# Altium schematic sheet Peripherals.SchDoc
size A4
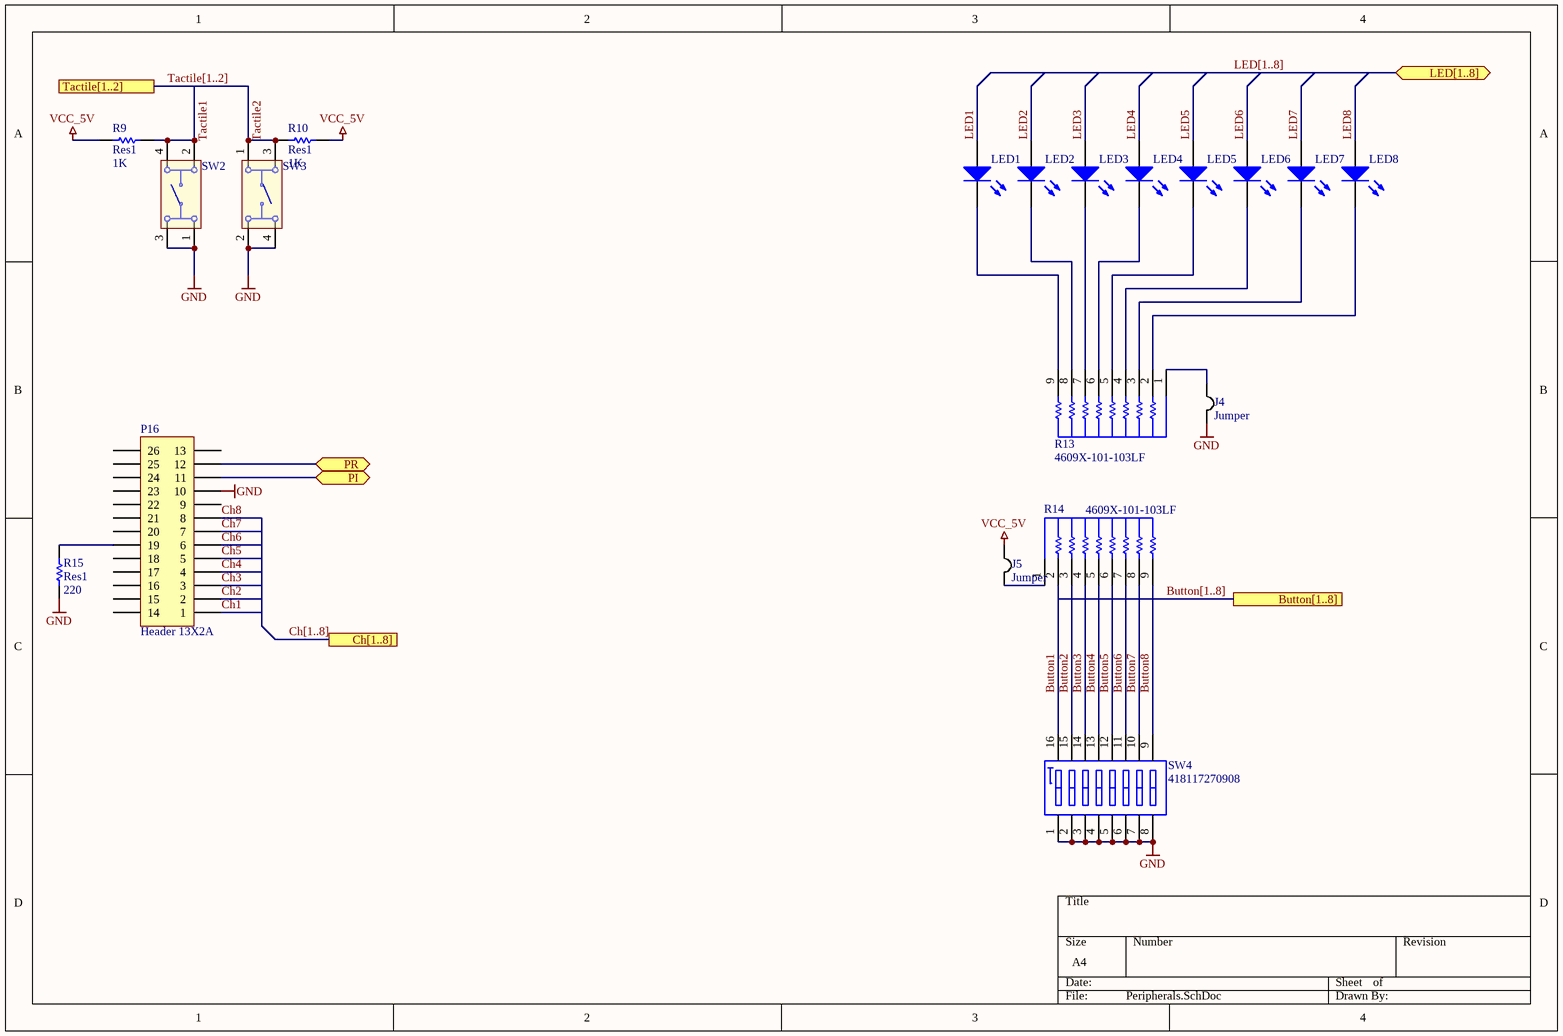
[diagram p0: Peripherals.SchDoc]

## Parts
J4  Jumper  [SMDJumper]
J5  Jumper  [SMDJumper]
LED1  TX1  [Type 3mm]  (value not drawn)
LED2  TX1  [Type 3mm]  (value not drawn)
LED3  TX1  [Type 3mm]  (value not drawn)
LED4  TX1  [Type 3mm]  (value not drawn)
LED5  TX1  [Type 3mm]  (value not drawn)
LED6  TX1  [Type 3mm]  (value not drawn)
LED7  TX1  [Type 3mm]  (value not drawn)
LED8  TX1  [Type 3mm]  (value not drawn)
P16  Header 13X2A  [HDR2X13_CEN]
R9  Res1  value 1K  [AXIAL-0.3]
R10  Res1  value 1K  [AXIAL-0.3]
R13  4609X-101-103LF  [BOUR-4609X]
R14  4609X-101-103LF  [BOUR-4609X]
R15  Res1  value 220  [AXIAL-0.3]
SW2  430156130726  [430156130726]  (value not drawn)
SW3  430156130726  [430156130726]  (value not drawn)
SW4  418117270908  [418117270908]

## Ports
Button[1..8], Ch[1..8], LED[1..8] (bidir), PI (bidir), PR (bidir), Tactile[1..2]

## Nets
GND: J4.2 P16.10 R15.1 SW2.1 SW2.3 SW3.2 SW3.4 SW4.1 SW4.2 SW4.3 SW4.4 SW4.5 SW4.6 SW4.7 SW4.8
VCC_5V: J5.1 R9.1 R10.2
Button1: R14.2 SW4.16
Button2: R14.3 SW4.15
Button3: R14.4 SW4.14
Button4: R14.5 SW4.13
Button5: R14.6 SW4.12
Button6: R14.7 SW4.11
Button7: R14.8 SW4.10
Button8: R14.9 SW4.9
Ch1: P16.1
Ch2: P16.2
Ch3: P16.3
Ch4: P16.4
Ch5: P16.5
Ch6: P16.6
Ch7: P16.7
Ch8: P16.8
LED1: LED1.2(A)
LED2: LED2.2(A)
LED3: LED3.2(A)
LED4: LED4.2(A)
LED5: LED5.2(A)
LED6: LED6.2(A)
LED7: LED7.2(A)
LED8: LED8.2(A)
PI: P16.11 ; port PI
PR: P16.12 ; port PR
Tactile1: R9.2 SW2.2 SW2.4
Tactile2: R10.1 SW3.1 SW3.3
NetJ4_1: J4.1 R13.1
NetJ5_2: J5.2 R14.1
NetLED1_1: LED1.1(K) R13.9
NetLED2_1: LED2.1(K) R13.8
NetLED3_1: LED3.1(K) R13.7
NetLED4_1: LED4.1(K) R13.6
NetLED5_1: LED5.1(K) R13.5
NetLED6_1: LED6.1(K) R13.4
NetLED7_1: LED7.1(K) R13.3
NetLED8_1: LED8.1(K) R13.2
NetP16_19: P16.19 R15.2

Not connected (* = marked no-connect by the designer): P16 9 13 14 15 16 17 18 20 21 22 23 24 25 26

## Buses and harness runs
bus Button[1..8] = port Button[1..8]
bus Ch[1..8] = port Ch[1..8]
bus LED[1..8] = port LED[1..8]
bus Tactile[1..2] = port Tactile[1..2]

## Library data of the parts
LED1-LED8 = CMP-1489-00003-1: THT LED round mono-color waterclear, WL-TMRW, Yellow; Manufacturer: Wuerth Elektronik; PartNumber: 151033YS03000; ComponentLink2Description: Datasheet; ComponentLink1Description: Manufacturer URL; Emitting color: Yellow; ComponentLink2URL: http://katalog.we-online.de/pbs/datasheet/7448042001.pdfhttp://katalog.we-online.de/pbs/datasheet/7448042001.pdfhttp://katalog.we-online.de/pbs/datasheet/7448042001.pdfhttp://katalog.we-online.de/pbs/datasheet/151033YS03000.pdf; ComponentLink1URL: http://www.we-online.com; PackageReference: Type 3mm
P16 = Header 13X2A: Header, 13-Pin, Dual row; LatestRevisionDate: 17-Jul-2002; LatestRevisionNote: Re-released for DXP Platform.; Publisher: Altium Limited
R9 R10 R15 = Res1: Resistor; Published: 8-Jun-2000; LatestRevisionDate: 17-Jul-2002; LatestRevisionNote: Re-released for DXP Platform.; PackageReference: AXIAL-0.3; Publisher: Altium Limited; PackageDescription: Axial Device, Thru-Hole; 2 Leads; 0.3 in Pin Spacing
R13 R14 = CMP-2000-05605-1: Resistor, Network, 1.13 W, 10 kOhm, -55 to 125 degC, 9-Pin THD, RoHS, Bulk; Manufacturer: Bourns; Tolerance: ±2%; Power, Rating: 1.13W; Resistance: 10kilohms; Temperature, Operating: -55to+125°C; Brand/Series: 4600XSeries; Circuit: BussedArray; Number of Resistors: 8; Package Type: SIP; Dimensions: 0.898x0.098x0.2(22.81x2.49x5.08)LxWxHin.(mm); Package Reference: 4609X; Mounting Technology: ThroughHole; Package Description: 9-Pin Through Hole Device, Body 22.81 x 2.49 mm, Pitch 2.54 mm; Number of Terminals: 9; Datasheet URL: https://datasheet.ciiva.com/11807/0900766b8069ccfd-11807021.pdf; Datasheet Version: 04/2010; Manufacturer URL: http://www.bourns.com/; Mounting Type: ThroughHole
SW2 SW3 = CMP-1453-00009-1: WS-TATV THT Tact Switch 6X6 mm; Manufacturer: Wuerth Elektronik; NoPins: 04; PartNumber: 430156130726; ComponentLink1Description: Manufacturer URL; ComponentLink1URL: http://www.we-online.com; ComponentLink2Description: Datasheet; ComponentLink2URL: http://katalog.we-online.de/em/datasheet/4301x6.pdf; PackageReference: 430156130726
SW4 = CMP-1435-00007-1: WS-DITV 2.54 mm Compact THT Dip Switch with Raised Actuator; Manufacturer: Wuerth Elektronik; NoPins: 16; ComponentLink2URL: http://katalog.we-online.de/em/datasheet/4181172709xx.pdf; ComponentLink1Description: Manufacturer URL; ComponentLink1URL: http://www.we-online.com; ComponentLink2Description: Datasheet; PackageReference: 418117270908; PartNumber: 418117270908